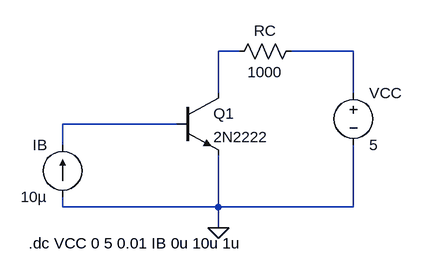
[diagram p0: schematic bjt-ic-vce-dc-sweeping.asc]
bjt-ic-vce-dc-sweeping.asc, the LTspice schematic file:
Version 4
SHEET 1 880 680
WIRE 272 64 240 64
WIRE 448 64 352 64
WIRE 240 128 240 64
WIRE 448 128 448 64
WIRE 176 176 0 176
WIRE 0 208 0 176
WIRE 0 304 0 288
WIRE 240 304 240 224
WIRE 240 304 0 304
WIRE 448 304 448 208
WIRE 448 304 240 304
WIRE 240 336 240 304
FLAG 240 336 0
SYMBOL npn 176 128 R0
SYMATTR InstName Q1
SYMATTR Value 2N2222
SYMBOL voltage 448 112 R0
WINDOW 123 0 0 Left 0
WINDOW 39 0 0 Left 0
SYMATTR InstName VCC
SYMATTR Value 5
SYMBOL current 0 288 R180
WINDOW 0 24 80 Left 2
WINDOW 3 24 0 Left 2
WINDOW 123 0 0 Left 0
WINDOW 39 0 0 Left 0
SYMATTR InstName IB
SYMATTR Value 10µ
SYMBOL res 368 48 R90
WINDOW 0 0 56 VBottom 2
WINDOW 3 32 56 VTop 2
SYMATTR InstName RC
SYMATTR Value 1000
TEXT -52 360 Left 2 !.dc VCC 0 5 0.01 IB 0u 10u 1u

The netlist it stands for:
* bjt-ic-vce-dc-sweeping.asc
Q1 N001 N003 0 0 2N2222
VCC N002 0 5
IB 0 N003 10µ
RC N002 N001 1000
.model NPN NPN
.model PNP PNP
.lib standard.bjt
.dc VCC 0 5 0.01 IB 0u 10u 1u
.backanno
.end